# EAGLE design CC2-32K-EPROM-CARTRIDGE-2012-V2R0 (EAGLE 5.10)
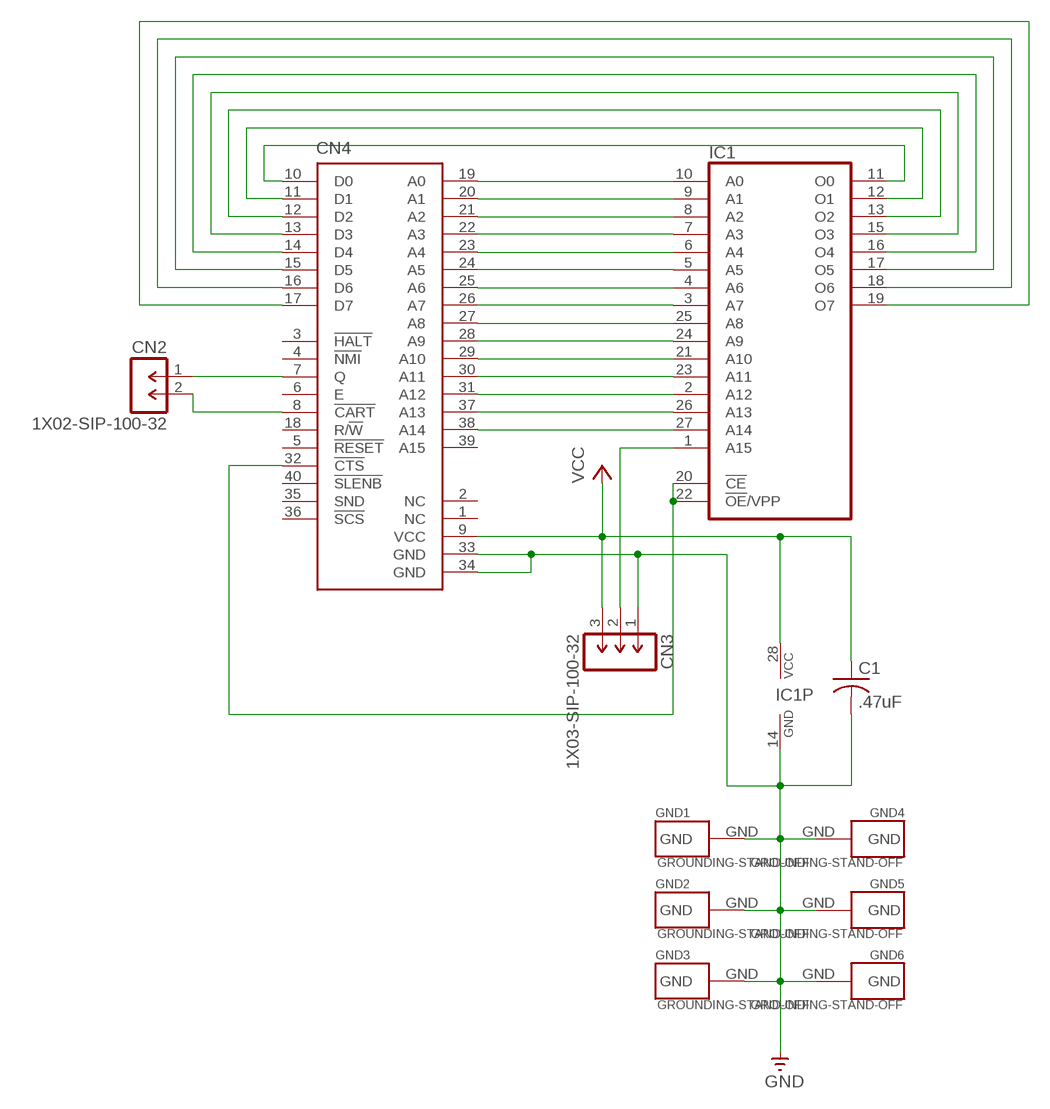
[diagram p0: schematic, sheet 1]

## Parts
C1  .47uF  NP-CAPACITOR-C050-025X075  [C050-025X075]
CN2  1X02-SIP-100-32  [SIL1X02-100]
CN3  1X03-SIP-100-32  [SIL1X03-100]
CN4  COCO3-CARTRIDGE-PLUG-SHORT  [EDGE-CARD-PLUG-2X20-100-SHORT]
GND1  GROUNDING-STAND-OFF  [STAND-OFF]
GND2  GROUNDING-STAND-OFF  [STAND-OFF]
GND3  GROUNDING-STAND-OFF  [STAND-OFF]
GND4  GROUNDING-STAND-OFF  [STAND-OFF]
GND5  GROUNDING-STAND-OFF  [STAND-OFF]
GND6  GROUNDING-STAND-OFF  [STAND-OFF]
IC1  27C512D-MINIMAL-OUTLINE  [DIL28-6-MINIMAL-OUTLINE]

## Nets
GND [power]: C1.2(-) CN3.1 CN4.33(GND) CN4.34(GND) GND1.GND GND2.GND GND3.GND GND4.GND GND5.GND GND6.GND IC1.14(GND)
N$2: CN2.1 CN4.7(Q)
N$3: CN2.2 CN4.8(!CART)
N$4: CN4.19(A0) IC1.10(A0)
N$5: CN4.20(A1) IC1.9(A1)
N$6: CN4.21(A2) IC1.8(A2)
N$7: CN4.22(A3) IC1.7(A3)
N$8: CN4.23(A4) IC1.6(A4)
N$9: CN4.24(A5) IC1.5(A5)
N$10: CN4.25(A6) IC1.4(A6)
N$11: CN4.26(A7) IC1.3(A7)
N$12: CN4.27(A8) IC1.25(A8)
N$13: CN4.28(A9) IC1.24(A9)
N$14: CN4.29(A10) IC1.21(A10)
N$15: CN4.30(A11) IC1.23(A11)
N$16: CN4.31(A12) IC1.2(A12)
N$17: CN4.37(A13) IC1.26(A13)
N$18: CN4.38(A14) IC1.27(A14)
N$19: CN3.2 IC1.1(A15)
N$21: CN4.10(D0) IC1.11(O0)
N$22: CN4.11(D1) IC1.12(O1)
N$23: CN4.12(D2) IC1.13(O2)
N$24: CN4.13(D3) IC1.15(O3)
N$25: CN4.14(D4) IC1.16(O4)
N$26: CN4.15(D5) IC1.17(O5)
N$27: CN4.16(D6) IC1.18(O6)
N$28: CN4.17(D7) IC1.19(O7)
N$29: CN4.32(!CTS) IC1.20(!CE) IC1.22(!OE!/VPP)
VCC [power]: C1.1(+) CN3.3 CN4.9(VCC) IC1.28(VCC)
Unconnected: CN4.1(NC) CN4.2(NC) CN4.3(!HALT) CN4.4(!NMI) CN4.5(!RESET) CN4.6(E) CN4.18(R/!W) CN4.35(SND) CN4.36(!SCS) CN4.39(A15) CN4.40(!SLENB)

## Library data of the parts
C1 = GIMEchip-Capacitor:NP-CAPACITOR: NON-POLARIZED CAPACITOR grid 5mm
CN2 = GIMEchip-Header-Generic:1X02: MALE HEADER
CN3 = GIMEchip-Header-Generic:1X03: MALE HEADER
CN4 = GIMEchip-TRS-80-CoCo-3-Program-Pak-Cartridge:COCO3-CARTRIDGE-PLUG: CoCo 3 Program Pak Cartridge Plug - http://www.GIMEchip.com/ Tandy Radio Shack TRS-80 Color Computer 3 Program Pak Cartridge Plug (Edge-Card) E.A.G.L.E. Library Part created by John Eric Turner & His Father - sales@gimechip.com <mailto:sales@gimechip.com?subject=Tandy Radio Shack TRS- 80 Color Computer 3 Program Pak Cartridge Plug (Edge-Card) E.A.G.L.E. Library Part> 40-Pin Edge-Card sharing the same pinout as the Program Pak Cartridge Edge-Card Connector. This library part has been designed to provide a 40-pin cartridge plug connector matching the CoCo's Edge-Card connector (Cartridge Slot). This library part is also useful with the Dragon and other CoCo clones. It is important to note that the CoCo 2 & 3 only provide +5V at the cartridge connector. The CoCo 1 provides +5V AND +/-12V at the cartridge connector. The Dragon provides only +5V and +12V at the cartridge connector. The table below lists all similarities and differences between these machines, relevant to the cartridge slot: PIN # TRS-80 "CoCo 1" Function Tano/Dragon Data "Dragon 32/64" Function TRS-80 "CoCo 2 & 3" Function 1 -12V +12V NC 2 +12V +12V NC 3 HALT* HALT* HALT* 4 NMI* NMI* NMI* 5 RESET* RESET* RESET* 6 E E E 7 Q Q Q 8 CART* CART* CART* 9 +5V +5V +5V 10 D0 D0 D0 11 D1 D1 D1 12 D2 D2 D2 13 D3 D3 D3 14 D4 D4 D4 15 D5 D5 D5 16 D6 D6 D6 17 D7 D7 D7 18 R/W* R/W* R/W* 19 A0 A0 A0 20 A1 A1 A1 21 A2 A2 A2 22 A3 A3 A3 23 A4 A4 A4 24 A5 A5 A5 25 A6 A6 A6 26 A7 A7 A7 27 A8 A8 A8 28 A9 A9 A9 29 A10 A10 A10 30 A11 A11 A11 31 A12 A12 A12 32 CTS* CSEL* CTS* 33 GND GND GND 34 GND GND GND 35 SND SND SND 36 SCS* P2* SCS* 37 A13 A13 A13 38 A14 A14 A14 39 A15 A15 A15 40 SLENB* DSD* SLENB*
GND1-GND6 = GIMEchip-Grounding:GROUNDING
IC1 = GIMEchip-EPROM:27C512D: MEMORY

## Net classes
0 default: width 0.203 mm, clearance 0.203 mm
1 power: width 0.762 mm, clearance 0.203 mm

## Board
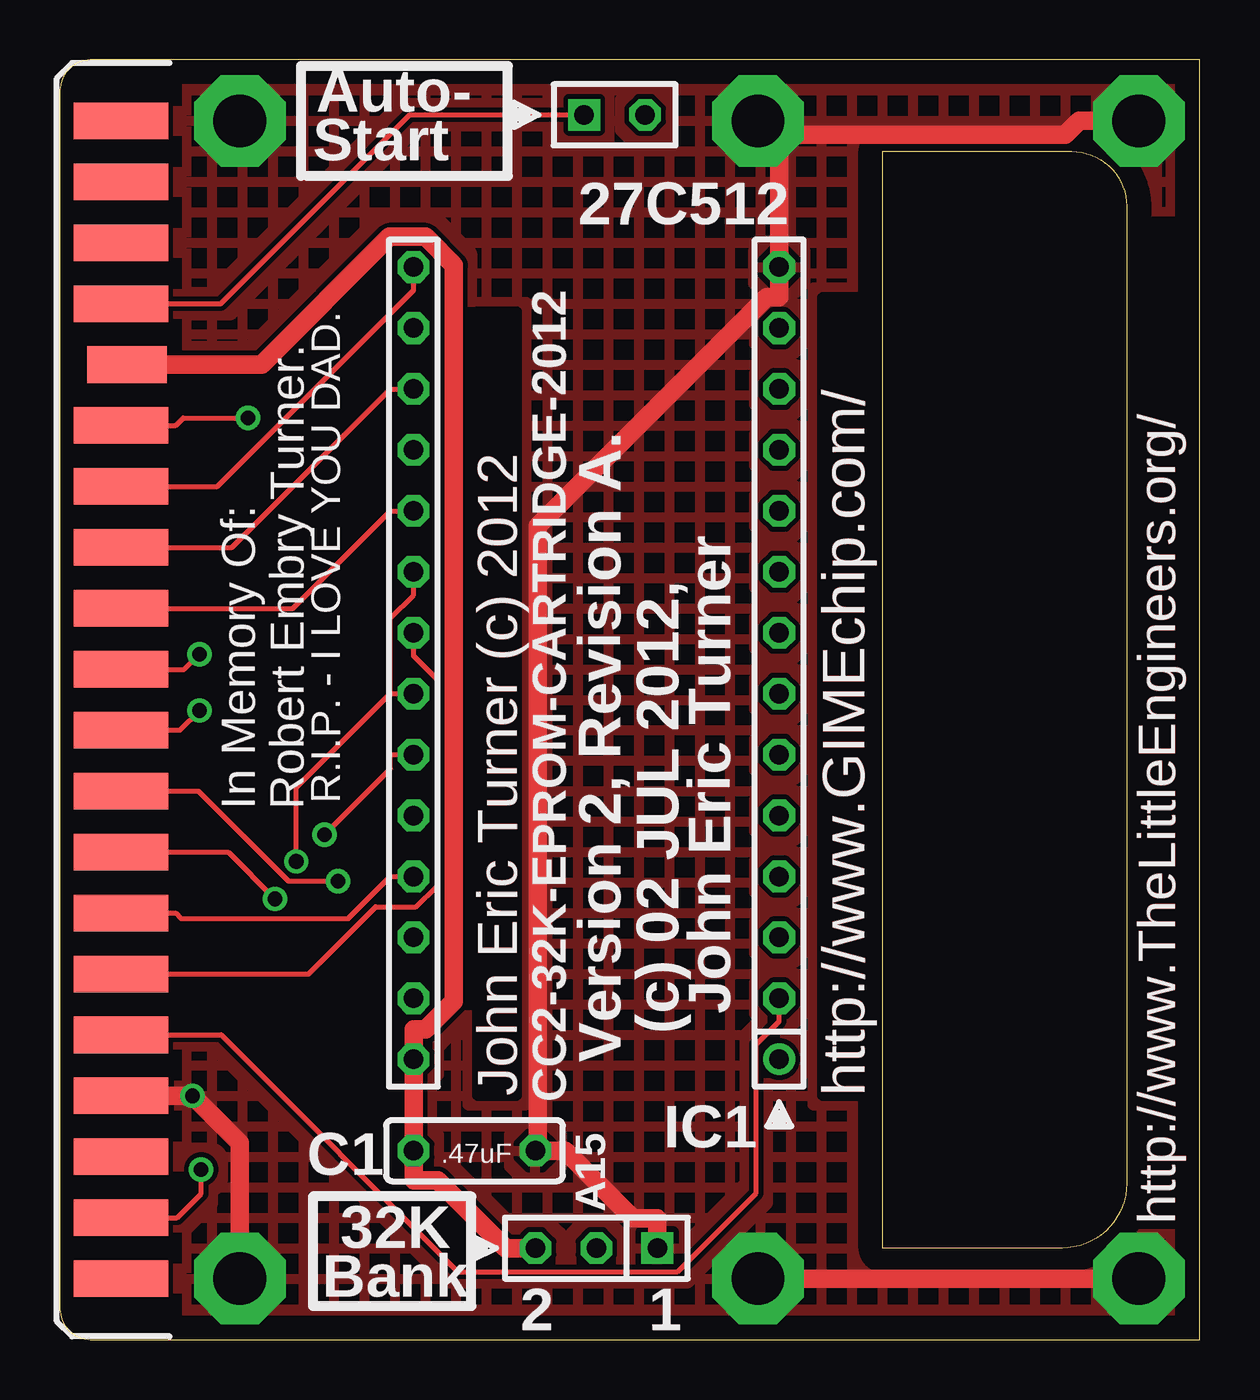
[diagram p1: board, top side]
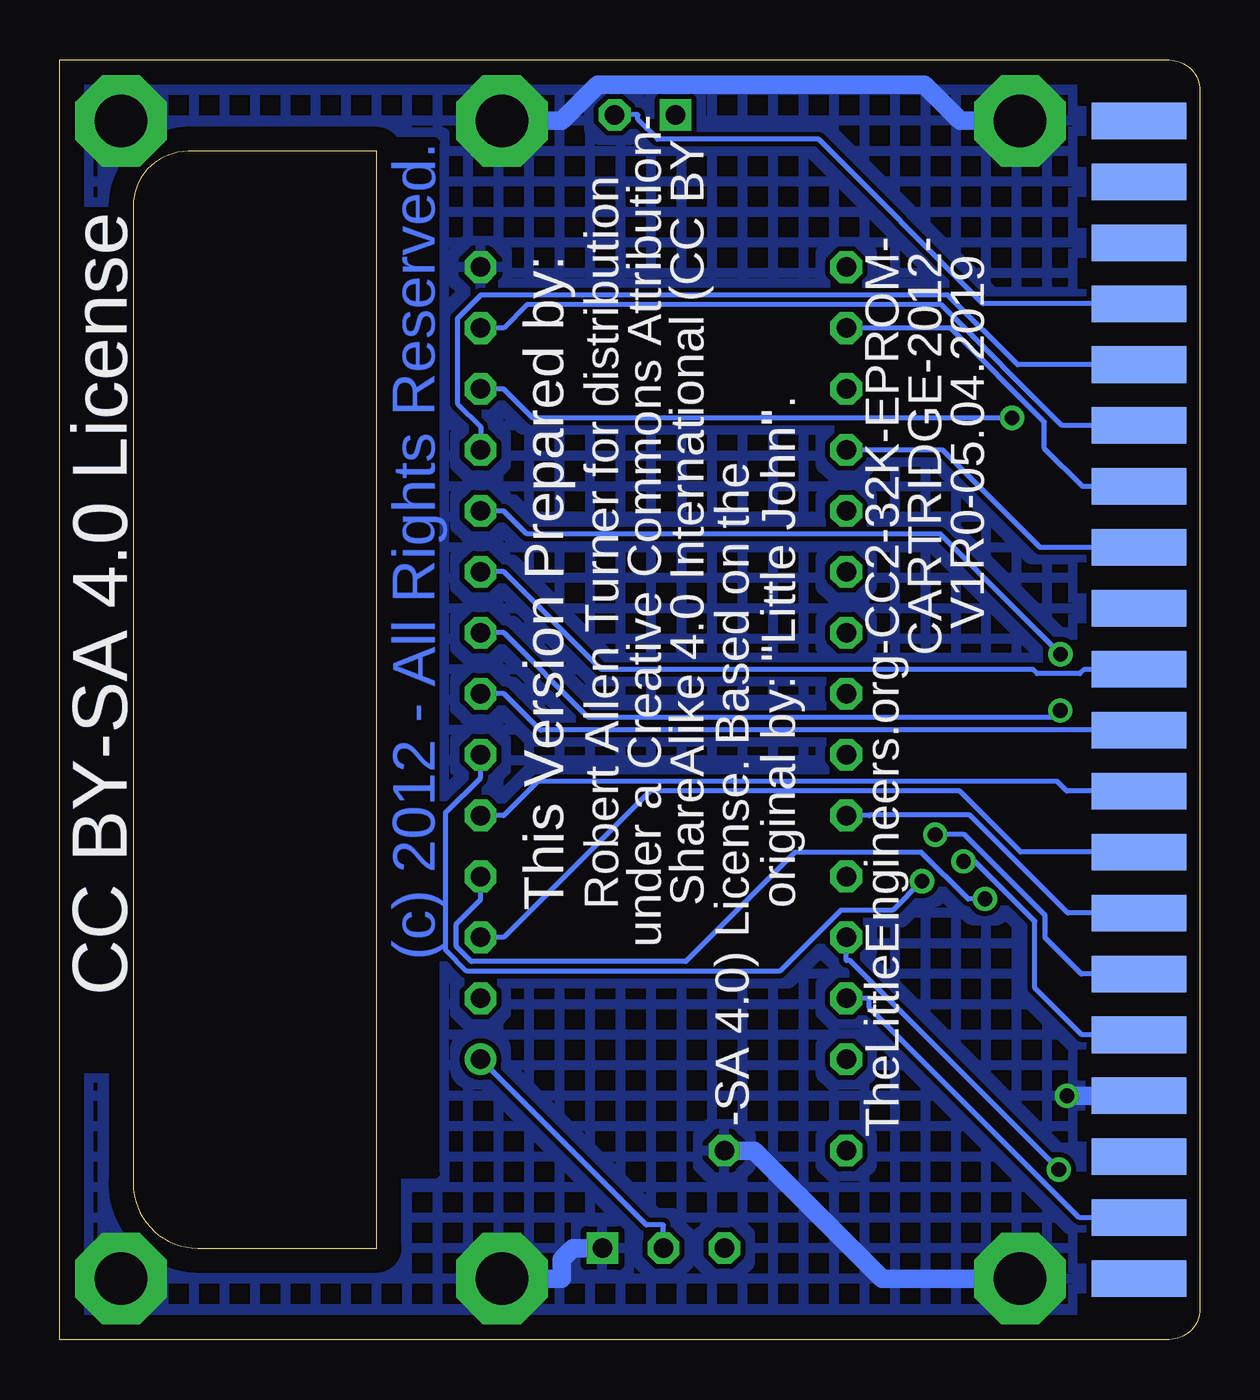
[diagram p2: board, bottom side, seen from below]

Size 47.5 x 53.34 mm. Coordinates in mm from the lower left corner, seen from the top.
Outline: 47.5,0 47.5,53.34 1.27,53.34 arc90 0,52.07 0,1.27 arc90 1.27,0 47.5,0
Outline: 34.29,49.53 42.16,49.53 arc-90 44.45,47.24 44.45,6.5 arc-90 41.76,3.81 34.29,3.81 34.29,49.53
Copper layers (1*16): Top 0.035mm / dielectric 1.5mm / Bottom 0.035mm
Design rules "default": minimum track width 10mil, minimum drill 24mil, track to track 8mil, track to pad 8mil, pad to pad 8mil, via to via 8mil, smd to smd 8mil, copper to edge 40mil, drill to drill 8mil, minimum pad ring 10mil, minimum via ring 8mil, stop-mask expansion 4mil, vias tented up to drill 0mil, thermal gap 10mil
vRestrict: area 15.2,8.9 to 29.2,49.5

### Footprints (pad centres in the part's own frame; a part is rotated, then mirrored left to right if it is on the bottom)
C050-025X075 = drill 0.813 octagon: 1 -2.54,0; 2 2.54,0
SIL1X02-100 = drill 0.813 square: 1 -1.27,0 | drill 0.813 octagon: 2 1.27,0
SIL1X03-100 = drill 0.813 square: 1 -2.54,0 | drill 0.813 octagon: 2 0,0; 3 2.54,0
EDGE-CARD-PLUG-2X20-100-SHORT = smd 3.937 x 1.524: 1 3.81,24.13; 3 3.81,21.59; 5 3.81,19.05; 7 3.81,16.51; 11 3.81,11.43; 13 3.81,8.89; 15 3.81,6.35; 17 3.81,3.81; 19 3.81,1.27; 21 3.81,-1.27; 23 3.81,-3.81; 25 3.81,-6.35; 27 3.81,-8.89; 29 3.81,-11.43; 31 3.81,-13.97; 33 3.81,-16.51; 35 3.81,-19.05; 37 3.81,-21.59; 39 3.81,-24.13 | smd 3.937 x 1.524 bottom: 2 3.81,24.13; 4 3.81,21.59; 6 3.81,19.05; 8 3.81,16.51; 10 3.81,13.97; 12 3.81,11.43; 14 3.81,8.89; 16 3.81,6.35; 18 3.81,3.81; 20 3.81,1.27; 22 3.81,-1.27; 24 3.81,-3.81; 26 3.81,-6.35; 28 3.81,-8.89; 30 3.81,-11.43; 32 3.81,-13.97; 34 3.81,-16.51; 36 3.81,-19.05; 38 3.81,-21.59; 40 3.81,-24.13 | smd 3.302 x 1.524: 9 4.064,13.97
STAND-OFF = drill 2.2 pad 3.81 octagon: GND 0,0
DIL28-6-MINIMAL-OUTLINE = drill 0.813 round: 1 -16.51,-7.62 | drill 0.813 octagon: 2 -13.97,-7.62; 3 -11.43,-7.62; 4 -8.89,-7.62; 5 -6.35,-7.62; 6 -3.81,-7.62; 7 -1.27,-7.62; 8 1.27,-7.62; 9 3.81,-7.62; 10 6.35,-7.62; 11 8.89,-7.62; 12 11.43,-7.62; 13 13.97,-7.62; 14 16.51,-7.62; 15 16.51,7.62; 16 13.97,7.62; 17 11.43,7.62; 18 8.89,7.62; 19 6.35,7.62; 20 3.81,7.62; 21 1.27,7.62; 22 -1.27,7.62; 23 -3.81,7.62; 24 -6.35,7.62; 25 -8.89,7.62; 26 -11.43,7.62; 27 -13.97,7.62; 28 -16.51,7.62

### Placement (x,y rotation side)
C1  17.27,7.87 0 top
CN2  23.11,51.05 0 top
CN3  22.35,3.81 180 top
CN4  -1.27,26.67 0 top
GND1  44.96,50.8 0 top
GND2  44.96,2.54 0 top
GND3  29.08,50.8 0 top
GND4  7.49,50.8 0 top
GND5  29.08,2.54 0 top
GND6  7.49,2.54 0 top
IC1  22.35,28.19 90 top

### Tracks (layer width: path | path; a pad name or v marks a point on that pad's centre or on a via)
GND  (via drill 0.61 pad 1.02)
  Top 0.762: GND5.GND GND2.GND | 19.91,7.87 19.91,33.91 29.46,43.46 29.97,43.46 IC1.14 29.97,45.95 29.97,50.22 | 19.91,7.87 21.06,7.87 23.88,5.05 24.89,5.05 CN3.1 | C1.2 19.91,7.87 | 29.97,50.22 41.89,50.22 42.47,50.8 GND1.GND | GND3.GND 29.66,50.22 29.97,50.22 | CN4.34 5.09,10.16 v5.53,10.16 7.49,8.19 GND6.GND
  Bottom 0.762: GND3.GND 26.59,50.8 25.09,52.3 11.48,52.3 9.98,50.8 GND4.GND | v5.53,10.16 CN4.34 | GND5.GND 26.59,2.54 26.59,3.35 26.14,3.81 CN3.1 | C1.2 18.57,7.87 13.23,2.54 GND6.GND
  pour Top (hatched): -0.51,53.34 47.5,53.34 47.5,0 -0.51,0
  pour Bottom (hatched): -0.51,53.34 47.5,53.34 47.5,0 -0.51,0
N$2
  Top 0.203: CN4.7 6.69,43.18 14.56,51.05 CN2.1
N$3
  Bottom 0.203: CN4.8 9.04,43.18 15.89,50.03 22.59,50.03 23.42,50.85 23.42,51.05 CN2.2
N$4  (via drill 0.61 pad 1.02)
  Top 0.203: CN4.19 5.17,27.94 v5.81,28.57
  Bottom 0.203: v5.81,28.57 10.81,33.58 28.04,33.58 29.01,34.54 IC1.10
N$5
  Bottom 0.203: CN4.20 4.81,27.94 4.99,27.76 6.78,27.76 6.96,27.94 24.94,27.94 29.01,32 IC1.9
N$6  (via drill 0.61 pad 1.02)
  Top 0.203: CN4.21 4.99,25.4 v5.81,26.22
  Bottom 0.203: IC1.8 29.01,29.46 25.48,25.94 6.1,25.94 v5.81,26.22
N$7
  Bottom 0.203: IC1.7 29.01,26.92 27.48,25.4 CN4.22
N$8  (via drill 0.61 pad 1.02)
  Top 0.203: v11.58,19.11 9.52,19.11 5.77,22.86 CN4.23
  Bottom 0.203: IC1.6 29.97,23.42 31.43,21.96 31.43,16.23 30.55,15.35 17.51,15.35 14.97,17.89 12.8,17.89 v11.58,19.11
N$9
  Bottom 0.203: IC1.5 29.01,21.84 27.58,23.27 5.95,23.27 5.54,22.86 CN4.24
N$10  (via drill 0.61 pad 1.02)
  Top 0.203: CN4.25 7,20.32 v8.96,18.36
  Bottom 0.203: IC1.4 29.97,18.34 30.98,17.33 30.98,16.38 30.36,15.76 21.42,15.76 16.87,20.31 11.6,20.31 9.66,18.36 v8.96,18.36
N$11
  Bottom 0.203: CN4.26 7.46,20.32 10,22.86 22.91,22.86 29.01,16.76 IC1.3
N$12
  Top 0.203: IC1.25 13.77,19.3 12.01,17.55 5.04,17.55 4.81,17.78 CN4.27
N$13
  Bottom 0.203: CN4.28 5.5,17.78 9.58,21.86 13.75,21.86 13.77,21.84 IC1.24
N$14
  Top 0.203: CN4.29 10.36,15.24 13.15,18.03 14.83,18.03 15.71,18.92 15.71,27.52 14.73,28.5 IC1.21
N$15  (via drill 0.61 pad 1.02)
  Top 0.203: IC1.23 13.77,24.38 13.77,23.79 v11.03,21.05
  Bottom 0.203: v11.03,21.05 9.82,21.05 6.45,17.68 6.45,16.75 4.93,15.24 CN4.30
N$16
  Top 0.203: IC1.2 29.97,13.26 29.01,12.29 29.01,6.1 25.74,2.83 16.59,2.83 6.72,12.7 CN4.31
N$17  (via drill 0.61 pad 1.02)
  Top 0.203: v5.88,7.09 5.88,6.08 4.88,5.08 CN4.37
  Bottom 0.203: IC1.26 14.73,15.8 14.59,15.8 v5.88,7.09
N$18
  Bottom 0.203: CN4.38 5.02,5.08 13.77,13.83 13.77,14.22 IC1.27
N$19
  Bottom 0.203: CN3.2 22.35,4.77 23.06,4.77 IC1.1
N$21
  Bottom 0.203: IC1.11 29.97,38.05 30.94,39.02 30.94,42.56 29.96,43.54 10.49,43.54 7.6,40.64 CN4.10
N$22  (via drill 0.61 pad 1.02)
  Top 0.203: v7.83,38.42 5.13,38.42 4.81,38.1 CN4.11
  Bottom 0.203: IC1.12 29.01,39.62 27.8,38.42 v7.83,38.42
N$23
  Bottom 0.203: CN4.12 5.75,38.1 10.78,43.13 28.04,43.13 29.01,42.16 IC1.13
N$24
  Top 0.203: IC1.15 14.73,43.74 6.55,35.56 CN4.13
N$25
  Bottom 0.203: 13.77,42.16 IC1.16 | CN4.14 4.89,35.56 6.47,37.14 6.47,38.25 10.39,42.16 13.77,42.16 | 13.77,42.16
N$26
  Top 0.203: IC1.17 13.77,39.62 7.16,33.02 CN4.15
N$27
  Bottom 0.203: IC1.18 10.72,37.08 6.65,33.02 CN4.16
N$28
  Top 0.203: IC1.19 13.77,34.54 9.7,30.48 CN4.17
N$29  (via drill 0.61 pad 1.02)
  Top 0.203: 13.77,26.92 13.77,30.07 14.73,31.04 IC1.20 | v9.85,19.93 9.85,23 13.77,26.92 | 13.77,26.92 IC1.22
  Bottom 0.203: v9.85,19.93 9.37,19.93 6.88,17.43 6.88,14.66 4.92,12.7 CN4.32
VCC
  Top 0.762: CN4.9 8.4,40.64 13.72,45.97 15.23,45.97 16.41,44.78 16.41,14.1 15.25,12.93 14.73,12.93 IC1.28 C1.1 14.73,6.63 15.75,6.63 18.57,3.81 CN3.3

### Text on the board
Top: John Eric Turner (c) 2012 | http://www.GIMEchip.com/ | http://www.TheLittleEngineers.org/
Bottom: (c) 2012 - All Rights Reserved. | CC BY-SA 4.0 License
tPlace: In Memory Of: | Robert Embry Turner. | R.I.P. - I LOVE YOU DAD.
bPlace: under a Creative Commons Attribution- | ShareAlike 4.0 International (CC BY | Robert Allen Turner for distribution | CC BY-SA 4.0 License | CARTRIDGE-2012- | TheLittleEngineers.org-CC2-32K-EPROM- | V1R0-05.04.2019 | This Version Prepared by: | original by: "Little John". | -SA 4.0) License. Based on the
tNames: Auto- | Start | 27C512 | GND3 | C1 | CN2 | CN3 | GND1 | GND2 | IC1 | CN4 | GND4 | GND6 | GND5 | John Eric Turner | (c) 02 JUL 2012, | Version 2, Revision A. | John Eric Turner (c) 2012 | http://www.GIMEchip.com/ | CC2-32K-EPROM-CARTRIDGE-2012 | IC1 | C1 | A15 | http://www.TheLittleEngineers.org/ | 32K | Bank | 2 | 1